# Altium schematic sheet 12mPCIe.SchDoc
size B
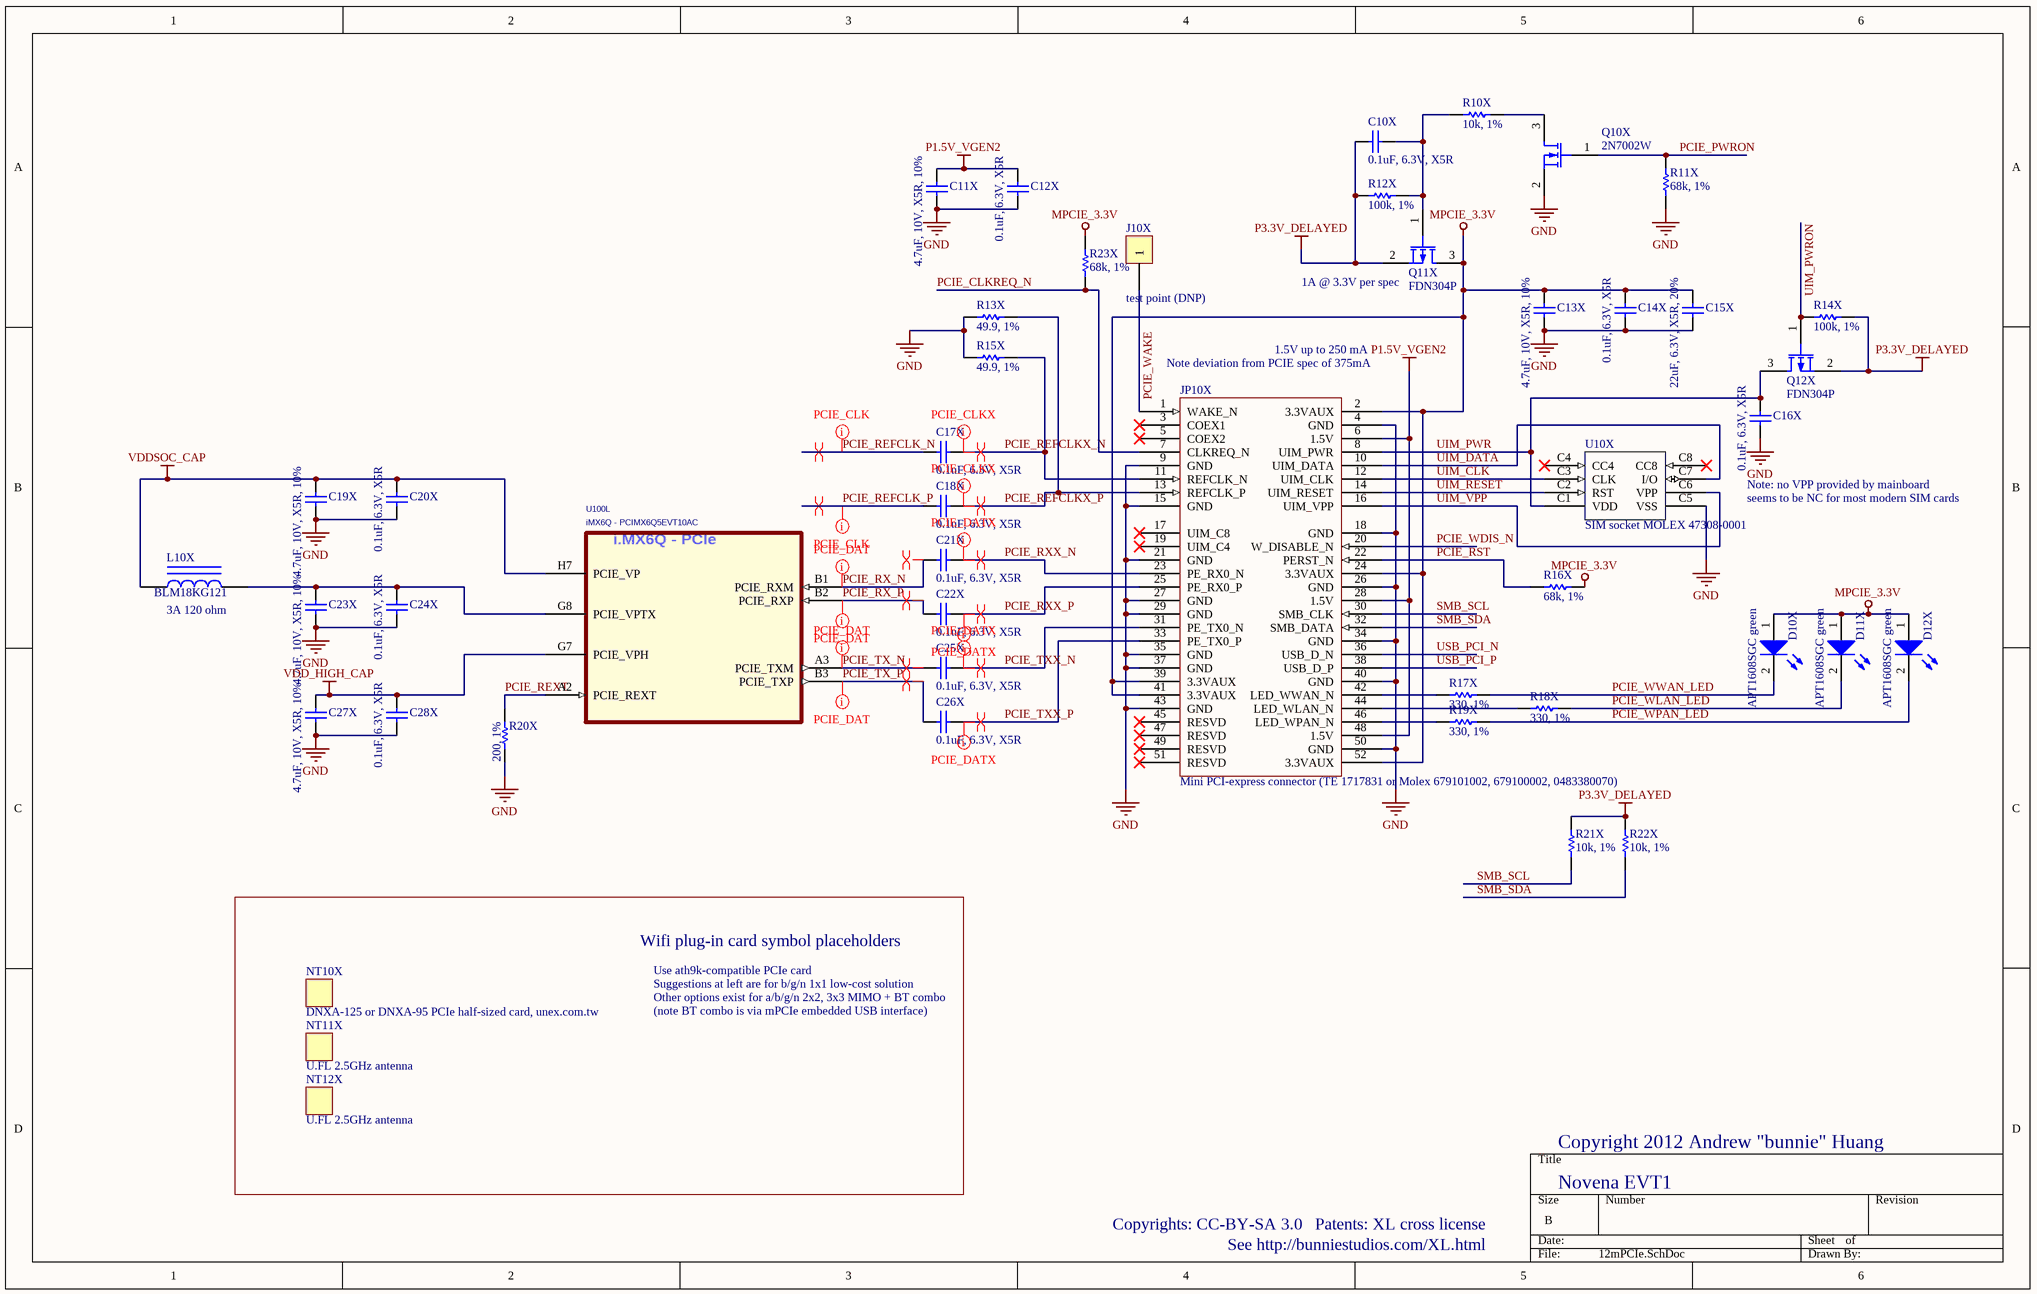
[diagram p0: 12mPCIe.SchDoc]

## Parts
C10X  0.1uF, 6.3V, X5R  [CAPC0603N_B]
C11X  4.7uF, 10V, X5R, 10%  [CAPC1608N]
C12X  0.1uF, 6.3V, X5R  [CAPC0603N_B]
C13X  4.7uF, 10V, X5R, 10%  [CAPC1608N]
C14X  0.1uF, 6.3V, X5R  [CAPC0603N_B]
C15X  22uF, 6.3V, X5R, 20%  [CAPC1608N_HD]
C16X  0.1uF, 6.3V, X5R  [CAPC0603N_B]
C17X  0.1uF, 6.3V, X5R  [CAPC0603N_B]
C18X  0.1uF, 6.3V, X5R  [CAPC0603N_B]
C19X  4.7uF, 10V, X5R, 10%  [CAPC1608N_HD]
C20X  0.1uF, 6.3V, X5R  [CAPC0603N_B]
C21X  0.1uF, 6.3V, X5R  [CAPC0603N_B]
C22X  0.1uF, 6.3V, X5R  [CAPC0603N_B]
C23X  4.7uF, 10V, X5R, 10%  [CAPC1608N_HD]
C24X  0.1uF, 6.3V, X5R  [CAPC0603N_B]
C25X  0.1uF, 6.3V, X5R  [CAPC0603N_B]
C26X  0.1uF, 6.3V, X5R  [CAPC0603N_B]
C27X  4.7uF, 10V, X5R, 10%  [CAPC1608N_HD]
C28X  0.1uF, 6.3V, X5R  [CAPC0603N_B]
D10X  APT1608SGC green  [CD1608-0603]
D11X  APT1608SGC green  [CD1608-0603]
D12X  APT1608SGC green  [CD1608-0603]
J10X  test point (DNP)  [TP_SMT_38mil]
JP10X  Mini PCI-express connector (TE 1717831 or Molex 679101002, 679100002, 0483380070)  [MPCI_FULL_TE_1717831]
L10X  BLM18KG121  value 3A 120 ohm  [INDC1608AN]
NT10X  DNXA-125 or DNXA-95 PCIe half-sized card, unex.com.tw
NT11X  U.FL 2.5GHz antenna
NT12X  U.FL 2.5GHz antenna
Q10X  2N7002W  [SOT323-3AN]
Q11X  FDN304P  [SOT23-3N]
Q12X  FDN304P  [SOT23-3N]
R10X  10k, 1%  [RESC1005N]
R11X  68k, 1%  [RESC1005N]
R12X  100k, 1%  [RESC1005N]
R13X  49.9, 1%  [RESC1005N]
R14X  100k, 1%  [RESC1005N]
R15X  49.9, 1%  [RESC1005N]
R16X  68k, 1%  [RESC1005N]
R17X  330, 1%  [RESC1005N]
R18X  330, 1%  [RESC1005N]
R19X  330, 1%  [RESC1005N]
R20X  200, 1%  [RESC1005N]
R21X  10k, 1%  [RESC1005N]
R22X  10k, 1%  [RESC1005N]
R23X  68k, 1%  [RESC1005N]
U10X  SIM socket MOLEX 47308-0001  [MOLEX_SIM_47308-001]
U100  iMX6Q - PCIMX6Q5EVT10AC  [FREESCALE_BGA624C80P25X25_2100X2100X216]  (part L of 12)

## Blocks framed on the sheet
Wifi plug-in card symbol placeholders: NT10X NT11X NT12X

## Nets
GND: C11X.2 C12X.2 C13X.2 C14X.2 C15X.2 C16X.2 C19X.2 C20X.2 C23X.2 C24X.2 C27X.2 C28X.2 JP10X.4(GND) JP10X.9(GND) JP10X.15(GND) JP10X.18(GND) JP10X.21(GND) JP10X.26(GND) JP10X.27(GND) JP10X.29(GND) JP10X.34(GND) JP10X.35(GND) JP10X.37(GND) JP10X.40(GND) JP10X.43(GND) JP10X.50(GND) Q10X.2(S) R11X.2 R13X.2 R15X.2 R20X.1 U10X.C5(VSS)
MPCIE_3.3V: C13X.1 C14X.1 C15X.1 D10X.1(A) D11X.1(A) D12X.1(A) JP10X.2(3.3VAUX) JP10X.24(3.3VAUX) JP10X.39(3.3VAUX) JP10X.41(3.3VAUX) JP10X.52(3.3VAUX) Q11X.3(D) R16X.1 R23X.2
P1.5V_VGEN2: C11X.1 C12X.1 JP10X.6(1.5V) JP10X.28(1.5V) JP10X.48(1.5V)
P3.3V_DELAYED: C10X.2 Q11X.2(S) Q12X.2(S) R12X.2 R14X.1 R21X.2 R22X.2
VDD_HIGH_CAP: C27X.1 C28X.1 U100.G7(PCIE_VPH)
VDDSOC_CAP: C19X.1 C20X.1 L10X.1 U100.H7(PCIE_VP)
PCIE_CLKREQ_N: JP10X.7(CLKREQ_N) R23X.1
PCIE_PWRON: Q10X.1(G) R11X.1
PCIE_REFCLK_N: C17X.2
PCIE_REFCLK_P: C18X.2
PCIE_REFCLKX_N: C17X.1 JP10X.11(REFCLK_N) R15X.1
PCIE_REFCLKX_P: C18X.1 JP10X.13(REFCLK_P) R13X.1
PCIE_REXT: R20X.2 U100.A2(PCIE_REXT)
PCIE_RST: JP10X.22(PERST_N) R16X.2
PCIE_RX_N: C21X.2 U100.B1(PCIE_RXM)
PCIE_RX_P: C22X.2 U100.B2(PCIE_RXP)
PCIE_RXX_N: C21X.1 JP10X.23(PE_RX0_N)
PCIE_RXX_P: C22X.1 JP10X.25(PE_RX0_P)
PCIE_TX_N: C25X.2 U100.A3(PCIE_TXM)
PCIE_TX_P: C26X.2 U100.B3(PCIE_TXP)
PCIE_TXX_N: C25X.1 JP10X.31(PE_TX0_N)
PCIE_TXX_P: C26X.1 JP10X.33(PE_TX0_P)
PCIE_WAKE: J10X.1 JP10X.1(WAKE_N)
PCIE_WDIS_N: JP10X.20(W_DISABLE_N)
PCIE_WLAN_LED: D11X.2(K) R18X.2
PCIE_WPAN_LED: D12X.2(K) R19X.2
PCIE_WWAN_LED: D10X.2(K) R17X.2
SMB_SCL: JP10X.30(SMB_CLK) R21X.1
SMB_SDA: JP10X.32(SMB_DATA) R22X.1
UIM_CLK: JP10X.12(UIM_CLK) U10X.C3(CLK)
UIM_DATA: JP10X.10(UIM_DATA) U10X.C7(I/O)
UIM_PWR: C16X.1 JP10X.8(UIM_PWR) Q12X.3(D) U10X.C1(VDD)
UIM_PWRON: Q12X.1(G) R14X.2
UIM_RESET: JP10X.14(UIM_RESET) U10X.C2(RST)
UIM_VPP: JP10X.16(UIM_VPP) U10X.C6(VPP)
USB_PCI_N: JP10X.36(USB_D_N)
USB_PCI_P: JP10X.38(USB_D_P)
NetC10X_1: C10X.1 Q11X.1(G) R10X.1 R12X.1
NetC23X_1: C23X.1 C24X.1 L10X.2 U100.G8(PCIE_VPTX)
NetJP10X_42: JP10X.42(LED_WWAN_N) R17X.1
NetJP10X_44: JP10X.44(LED_WLAN_N) R18X.1
NetJP10X_46: JP10X.46(LED_WPAN_N) R19X.1
NetQ10X_3: Q10X.3(D) R10X.2

Not connected (* = marked no-connect by the designer): JP10X 3(COEX1)* 5(COEX2)* 17(UIM_C8)* 19(UIM_C4)* 45(RESVD)* 47(RESVD)* 49(RESVD)* 51(RESVD)*; U10X C4(CC4)* C8(CC8)*

## Layout directives
differential pair: PCIE_REFCLK_N, PCIE_REFCLK_P, PCIE_REFCLKX_N, PCIE_REFCLKX_P, PCIE_RX_N, PCIE_RX_P, PCIE_RXX_N, PCIE_RXX_P, PCIE_TX_N, PCIE_TX_P, PCIE_TXX_N, PCIE_TXX_P
net class PCIE_CLK: PCIE_REFCLK_N, PCIE_REFCLK_P
net class PCIE_DAT: PCIE_RX_N, PCIE_RX_P, PCIE_TX_N, PCIE_TX_P
net class PCIE_DATX: PCIE_RXX_N, PCIE_RXX_P, PCIE_TXX_N, PCIE_TXX_P
net class PCIE_CLKX: PCIE_REFCLKX_N, PCIE_REFCLKX_P

## Notes on the sheet
- (near Q11X) 1A @ 3.3V per spec
- (near JP10X) Note deviation from PCIE spec of 375mA
- 1.5V up to 250 mA
- Note: no VPP provided by mainboard
- seems to be NC for most modern SIM cards
- Use ath9k-compatible PCIe card
- Suggestions at left are for b/g/n 1x1 low-cost solution
- Other options exist for a/b/g/n 2x2, 3x3 MIMO + BT combo
- (note BT combo is via mPCIe embedded USB interface)
- Copyright 2012 Andrew "bunnie" Huang
- Copyrights: CC-BY-SA 3.0
- Patents: XL cross license
- Novena EVT1
- See http://bunniestudios.com/XL.html
- (in symbol PCIMX6Q6VV1A, part L) i.MX6Q - PCIe

## Library data of the parts
C10X C11X C12X C13X C14X C15X C16X C17X C18X C19X C20X C21X C22X C23X C24X C25X C26X C27X C28X = Cap Semi: Capacitor (Semiconductor SIM Model); Published: 8-Jun-2000; LatestRevisionDate: 17-Jul-2002; LatestRevisionNote: Re-released for DXP Platform.; PackageReference: C1206; Publisher: Altium Limited
D10X D11X D12X = LED2: Typical RED, GREEN, YELLOW, AMBER GaAs LED; Published: 8-Jun-2000; LatestRevisionDate: 17-Jul-2002; LatestRevisionNote: Re-released for DXP Platform.; PackageVersion: Feb-2002; PackageReference: 3.2X1.6X1.1; Publisher: Altium Limited
J10X = CON1: Connector
JP10X = MINI_PCIE: Mini PCI-express, e.g. TE 1717831
L10X = Inductor Iron: Magnetic-Core Inductor; Published: 24-Mar-1999; LatestRevisionDate: 17-Jul-2002; LatestRevisionNote: Re-released for DXP Platform.; PackageReference: AXIAL-0.9; Publisher: Altium Limited
NT10X NT11X NT12X = NOTE: Placeholder for non-electrical BOM items
Q10X = MOSFET-N: N-Channel MOSFET; Published: 8-Jun-2000; LatestRevisionDate: 17-Jul-2002; LatestRevisionNote: Re-released for DXP Platform.; PackageVersion: 1995/1996; PackageReference: E3; Publisher: Altium Limited
Q11X Q12X = MOSFET-P: P-Channel MOSFET; Published: 8-Jun-2000; LatestRevisionDate: 17-Jul-2002; LatestRevisionNote: Re-released for DXP Platform.; PackageVersion: 1995/1996; PackageReference: E3; Publisher: Altium Limited; PackageDescription: TO, Flat Index; 3 In-Line, Axial Leads; Body Dia. 4.6mm; Lead Dia. 0.5 mm (max)
R10X R11X R13X R15X R16X R17X R18X R19X R20X R21X R22X R23X = Res1: Resistor; Value: 100k; Published: 8-Jun-2000; LatestRevisionDate: 17-Jul-2002; LatestRevisionNote: Re-released for DXP Platform.; PackageReference: AXIAL-0.3; Publisher: Altium Limited
R12X R14X = Res1: Resistor; Published: 8-Jun-2000; LatestRevisionDate: 17-Jul-2002; LatestRevisionNote: Re-released for DXP Platform.; PackageReference: AXIAL-0.3; Publisher: Altium Limited; Value: 100k
U10X = ISO7816 (SIM card): ISO 7816 SIM card socket
U100 = PCIMX6Q6VV1A: PCIMX6Q5EVT10AC; AGILE_PN: TMP-WF-14526; DESCRIPTION: PLACEHOLDER FOR FREESCALE PART NUMBER PMCIMX6Q6VV1A.; MFG_NAME01: Freescale Semiconductor; PRE_APN: 344-01218; MFG_PN01: PCIMX6Q6VV1A; ROHS: Yes; HEIGHT: 2.16MM